# Altium schematic sheet B_PITCHROLLER.schdoc
size 280 x 212 mm
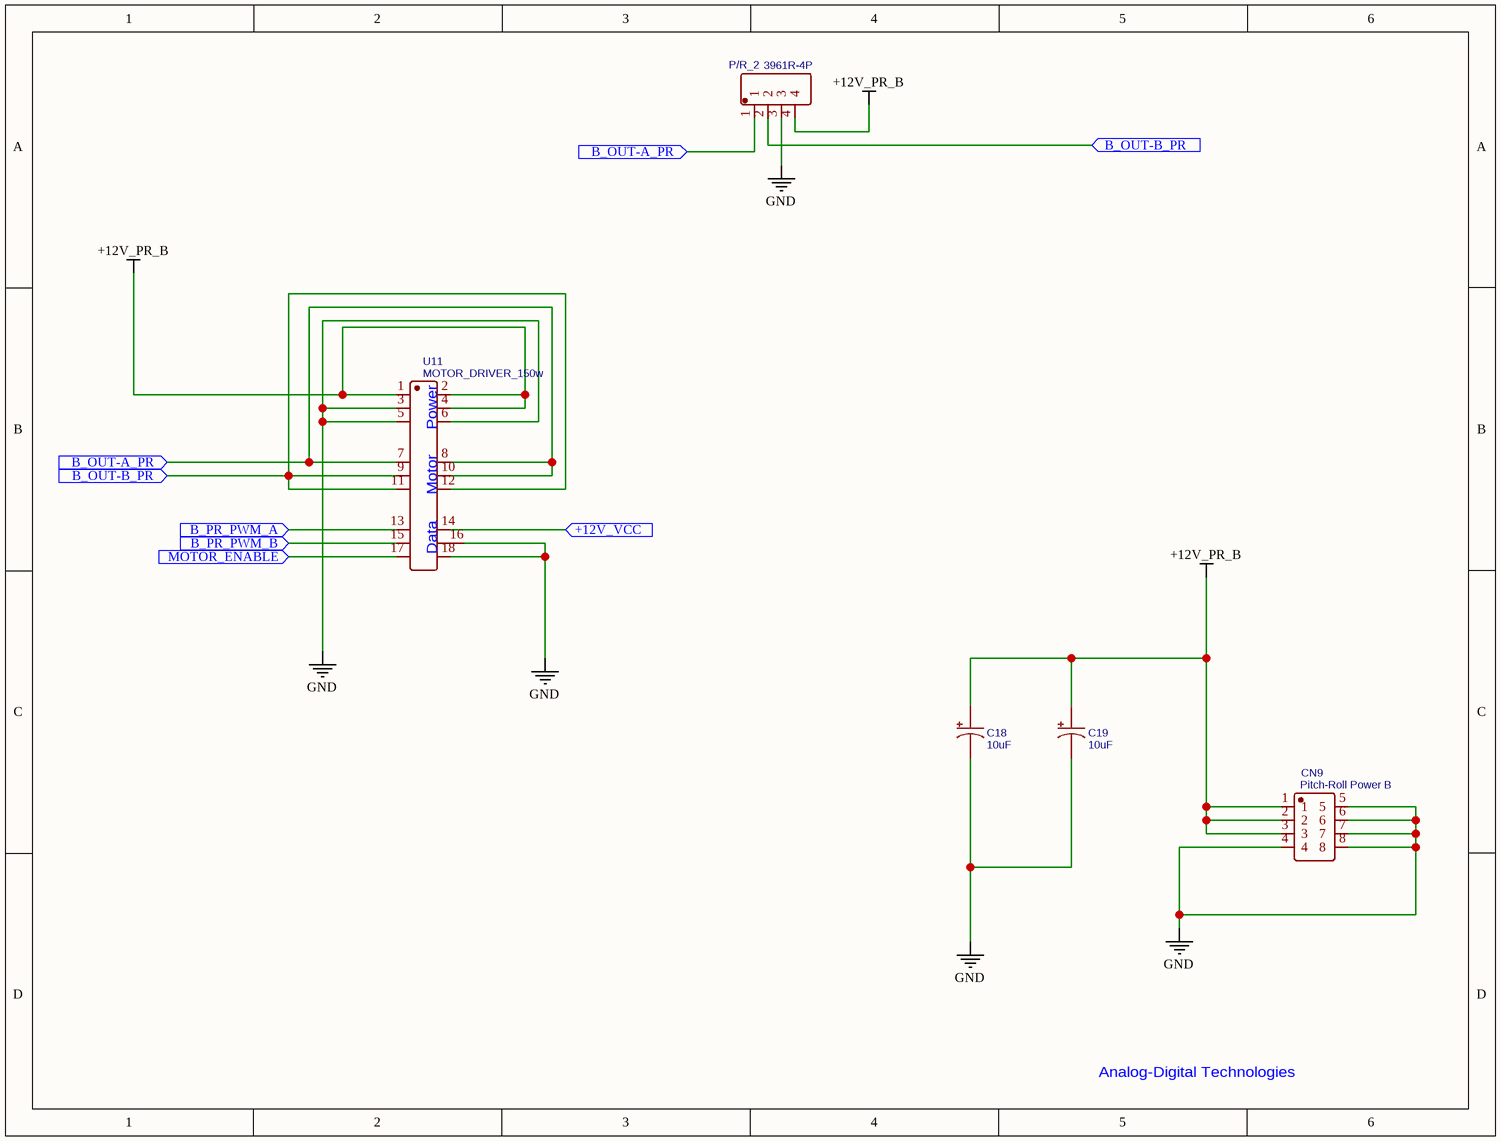
[diagram p0: B_PITCHROLLER.schdoc]

## Parts
C18  10uF  [CAP-SMD_BD4.0-L4.3-W4.3-FD]
C19  10uF  [CAP-SMD_BD4.0-L4.3-W4.3-FD]
CN9  Pitch-Roll Power B  [CONN-TH_8P-P4.20_X9357WV-2-04-N2SN]
P/R_2  3961R-4P  [CONN-TH_4P-P3.96_3961R-4P]
U11  MOTOR_DRIVER_150w  [MOTOR_DRIVE_150W_MODULE]

## Ports
+12V_VCC (in), B_OUT-A_PR (in), B_OUT-B_PR (in), B_PR_PWM_A (in), B_PR_PWM_B (in), MOTOR_ENABLE (in)

## Nets
+12V_PR_B: C18.1 C19.1 CN9.1 CN9.2 CN9.3 P/R_2.4 U11.1(+12V_YAW) U11.2(+12V_YAW) U11.4(+12V_YAW)
GND: C18.2 C19.2 CN9.4 CN9.5 CN9.6 CN9.7 CN9.8 P/R_2.3 U11.3(GND) U11.5(GND) U11.6(GND) U11.16(GND) U11.18(GND)
+12V_VCC: U11.14(+12V_VCC) ; port +12V_VCC
B_OUT-A_PR: P/R_2.1 U11.7(OUT-A_YAW) U11.8(OUT-A_YAW) U11.10(OUT-A_YAW) ; port B_OUT-A_PR
B_OUT-B_PR: P/R_2.2 U11.9(OUT-B_YAW) U11.11(OUT-B_YAW) U11.12(OUT-B_YAW) ; port B_OUT-B_PR
B_PR_PWM_A: U11.13(PWM-A_YAW) ; port B_PR_PWM_A
B_PR_PWM_B: U11.15(PWM-B_YAW) ; port B_PR_PWM_B
MOTOR_ENABLE: U11.17(MOTOR_ENABLE) ; port MOTOR_ENABLE

## Notes on the sheet
- Analog-Digital Technologies
- (in symbol MOTOR_DRIVER_150w) Power; Motor; Data

## Library data of the parts
C18 C19 = 10uF: BOM_Manufacturer: ROQANG; BOM_Manufacturer Part: VT1E100M0405; nameAlias: Capacitance; Contributor: LCSC; BOM_Supplier: LCSC; BOM_Supplier Part: C213486; BOM_JLCPCB Part Class: Extended Part; JLCPCB Part Class: Extended Part; spicePre: C; spiceSymbolName: VT1E100M0405
CN9 = Pitch-Roll Power B: BOM_Manufacturer: XKB Enterprise; BOM_Manufacturer Part: X9357WV-2*04-N2SN; Contributor: LCSC; BOM_Supplier: LCSC; BOM_Supplier Part: C519240; BOM_JLCPCB Part Class: Extended Part; spicePre: C; spiceSymbolName: X9357WV-2*04-N2SN
P/R_2 = 3961R-4P: BOM_Manufacturer: Ckmtw; Contributor: LCSC; BOM_Supplier: LCSC; BOM_Manufacturer Part: 3961R-4P; BOM_Supplier Part: C138427; BOM_JLCPCB Part Class: Extended Part; spicePre: C; spiceSymbolName: 3961R-4P
U11 = MOTOR_DRIVER_150w: Contributor: digitalman; spicePre: U; spiceSymbolName: MOTOR_DRIVER_150w